# Altium schematic sheet Peripherals.SchDoc
size A4; SheetNumber: 7; SheetTotal: 7
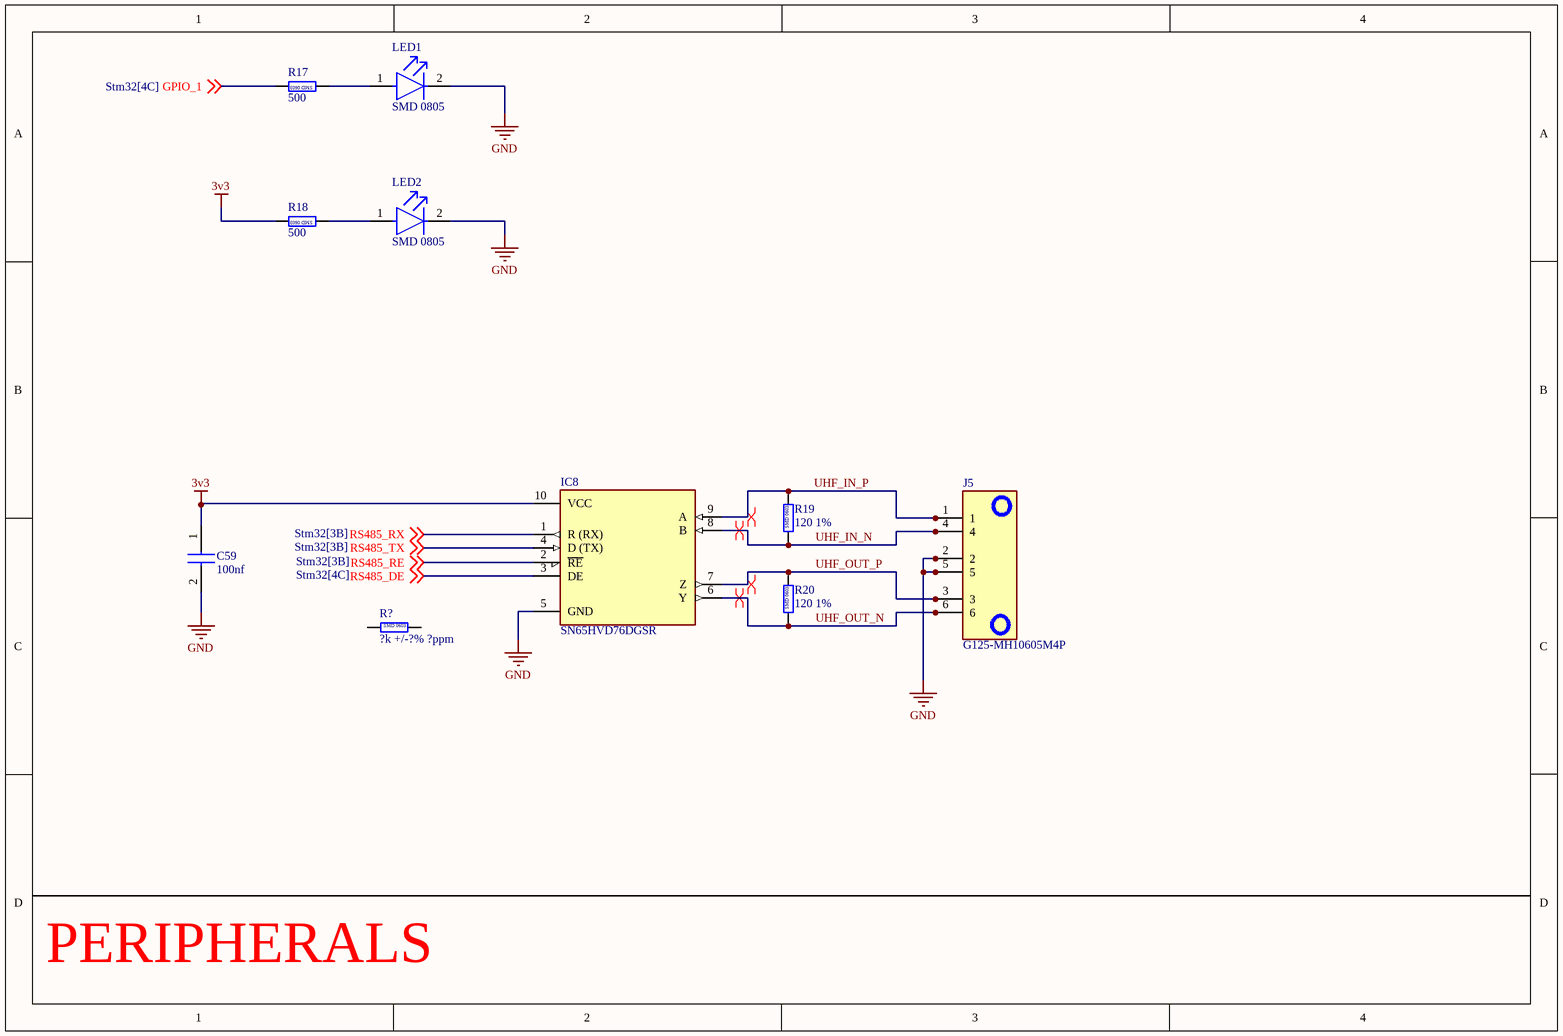
[diagram p0: Peripherals.SchDoc]

## Parts
C59  100nf  [CAPC1608X87N]
IC8  SN65HVD76DGSR  [SOP50P490X110-10N]
J5  G125-MH10605M4P  [G125-MH10605M4P_1]
LED1  SMD 0805  [FP-SM0805YCL-MFG]
LED2  SMD 0805  [FP-SM0805YCL-MFG]
R17  500  [RES_0603]
R18  500  [RES_0603]
R19  120 1%  [RES_0603]
R20  120 1%  [RES_0603]
R?  ?k +/-?% ?ppm  [RES_0603]

## Nets
3v3: C59.1 IC8.10(VCC) R18.2
GND: C59.2 IC8.5(GND) J5.2 J5.5 LED1.2(C) LED2.2(C)
GPIO_1: R17.2 ; off-sheet GPIO_1
RS485_DE: IC8.3(DE) ; off-sheet RS485_DE
RS485_RE: IC8.2(~{RE}) ; off-sheet RS485_RE
RS485_RX: IC8.1(R_(RX)) ; off-sheet RS485_RX
RS485_TX: IC8.4(D_(TX)) ; off-sheet RS485_TX
UHF_IN_N: IC8.8(B) J5.4 R19.1
UHF_IN_P: IC8.9(A) J5.1 R19.2
UHF_OUT_N: IC8.6(Y) J5.6 R20.1
UHF_OUT_P: IC8.7(Z) J5.3 R20.2
NetLED1_1: LED1.1(A) R17.1
NetLED2_1: LED2.1(A) R18.1

Not connected (* = marked no-connect by the designer): R? 1 2

## Layout directives
differential pair: UHF_IN_N, UHF_IN_P, UHF_OUT_N, UHF_OUT_P

## Notes on the sheet
- PERIPHERALS
- (in symbol Resistor-SMD-0603) SMD 0603

## Library data of the parts
C59 = 0603N470J500CT: Capacitor; Manufacturer_Name: Walsin Technology Corporation; Datasheet Link: https://datasheet.datasheetarchive.com/originals/distributors/DKDS41/DSANUWW0027552.pdf; Height: 0.87mm; Manufacturer_Part_Number: 0603N470J500CT; Mouser Part Number: 791-0603N470J500CT; Mouser Price/Stock: https://www.mouser.co.uk/ProductDetail/Walsin/0603N470J500CT?qs=ZrPdAQfJ6DOWJe9N0xQVbw%3D%3D
IC8 = SN65HVD76DGSR: RS485 Full Duplex Transciever; Manufacturer_Name: Texas Instruments; Datasheet Link: http://www.ti.com/lit/gpn/sn65hvd76; Height: 1.1mm; Manufacturer_Part_Number: SN65HVD76DGSR; Mouser Part Number: 595-SN65HVD76DGSR; Mouser Price/Stock: https://www.mouser.co.uk/ProductDetail/Texas-Instruments/SN65HVD76DGSR?qs=7z%252BmIopC6%2FI%252B8LLIzcebYw%3D%3D; Arrow Part Number: SN65HVD76DGSR; Arrow Price/Stock: https://www.arrow.com/en/products/sn65hvd76dgsr/texas-instruments?region=nac
J5 = G125-MH10605M4P: Connector; Manufacturer_Name: Harwin; Datasheet Link: https://content.harwin.com/m/667f1be9427fb768/original/DRG-02921-Technical-Drawing-Datasheet-G125-MH1XX05M4P-pdf.pdf; Height: 5.3mm; Manufacturer_Part_Number: G125-MH10605M4P; Mouser Part Number: 855-G125MH1065M4PM4P; Mouser Price/Stock: https://www.mouser.co.uk/ProductDetail/Harwin/G125-MH10605M4P?qs=vHuUswq2%252BswF07IXFR1W6A%3D%3D
LED1 LED2 = CMP-35283-000007-1: LED YELLOW CLEAR 0805 SMD; Luminous Intensity: 11.5mcd; Test Current: 2mA; Viewing Angle: 130°; Dominant Wavelength: 592nm; Forward Voltage: 1.9V; Lens Color: Colorless; Case Code (Metric): 2012; Illumination Color: Yellow; Length: 2mm; Max Operating Temperature: 80°C; Width: 1.2mm; Case Code (Imperial): 0805; Packaging: Tape and Reel; Lens Transparency: Clear; Mount: Surface Mount; Case/Package: 0805; Forward Current: 2mA; Height: 0.8mm; Lead Free: Lead Free; Min Operating Temperature: -30°C; Color: Yellow; Package Quantity: 4000
R17-R20 R? = Resistor-SMD-0603: Resistor SMD 0603 RATED